# Altium schematic sheet Адаптер_USB-DMX512.SchDoc
size 209 x 297 mm; Author: Скляр Р.С.; Organization: S-LAB; Address1: 2436.181092.5167; DocumentNumber: 1; SheetNumber: 1; SheetTotal: 3; PageSetup: Record=PageOptions|CenterHorizontal=True|CenterVertical=True|PrintScale=0.94|XCorrection=1.00|YCorrection=1.00|PrintKind=1|BorderSize=5000000|LeftOffset=0|BottomOffset=0|Orientation=1|PaperLength=1000|PaperWidth=1000|Scale=100|PaperSource=7|PrintQuality=-4|MediaType=1|DitherType=10|PaperKind=A4|PrintScaleMode=1; Name: Контроллер управления; Name1: USB-DMX512; Scale: 1:1; DocumentName: Sheet1.SCHDOC
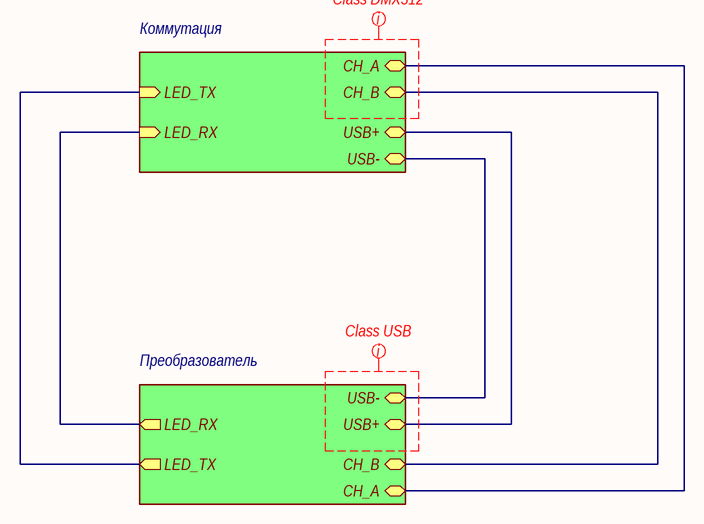
[diagram p0: Адаптер_USB-DMX512.SchDoc]

## Sub-sheets
Коммутация = Коммутация.SchDoc: LED_TX (in), CH_B (bidir), CH_A (bidir), LED_RX (in), USB+ (bidir), USB- (bidir)
Преобразователь = Преобразователь.SchDoc: CH_A (bidir), CH_B (bidir), LED_TX (out), LED_RX (out), USB- (bidir), USB+ (bidir)

## Nets
(unnamed): sheet Коммутация/LED_TX, sheet Преобразователь/LED_TX
(unnamed): sheet Коммутация/CH_B, sheet Преобразователь/CH_B
(unnamed): sheet Коммутация/CH_A, sheet Преобразователь/CH_A
(unnamed): sheet Коммутация/LED_RX, sheet Преобразователь/LED_RX
(unnamed): sheet Коммутация/USB+, sheet Преобразователь/USB+
(unnamed): sheet Коммутация/USB-, sheet Преобразователь/USB-

## Layout directives
net class USB 2.0: (no net found under the mark)
net class DMX 512: (no net found under the mark)

## Notes on the sheet
- Перв.примен.
- Справ.№
- Подп. и дата
- Инв.№ дубл.
- Взам.инв.№
- Подп.и дата
- Разраб.
- Изм.
- Лист
- № докум.
- Подп.
- Дата
- Лит.
- Масса
- Масштаб
- Т.контр.
- Пров.
- Схема электрическая
- структурная
- Листов
- Инв.№ подл.
- Утв.
- Н.контр.
- Нач.сект.
- Копировал
- Формат  A4